# EasyEDA schematic SCH_night-light_2024-06-19.json
TITLE: Sheet_1; REV: 1.0; Date: 2024-06-19; Sheet: 1/1; Drawn By: ercrice; Company: Your Company
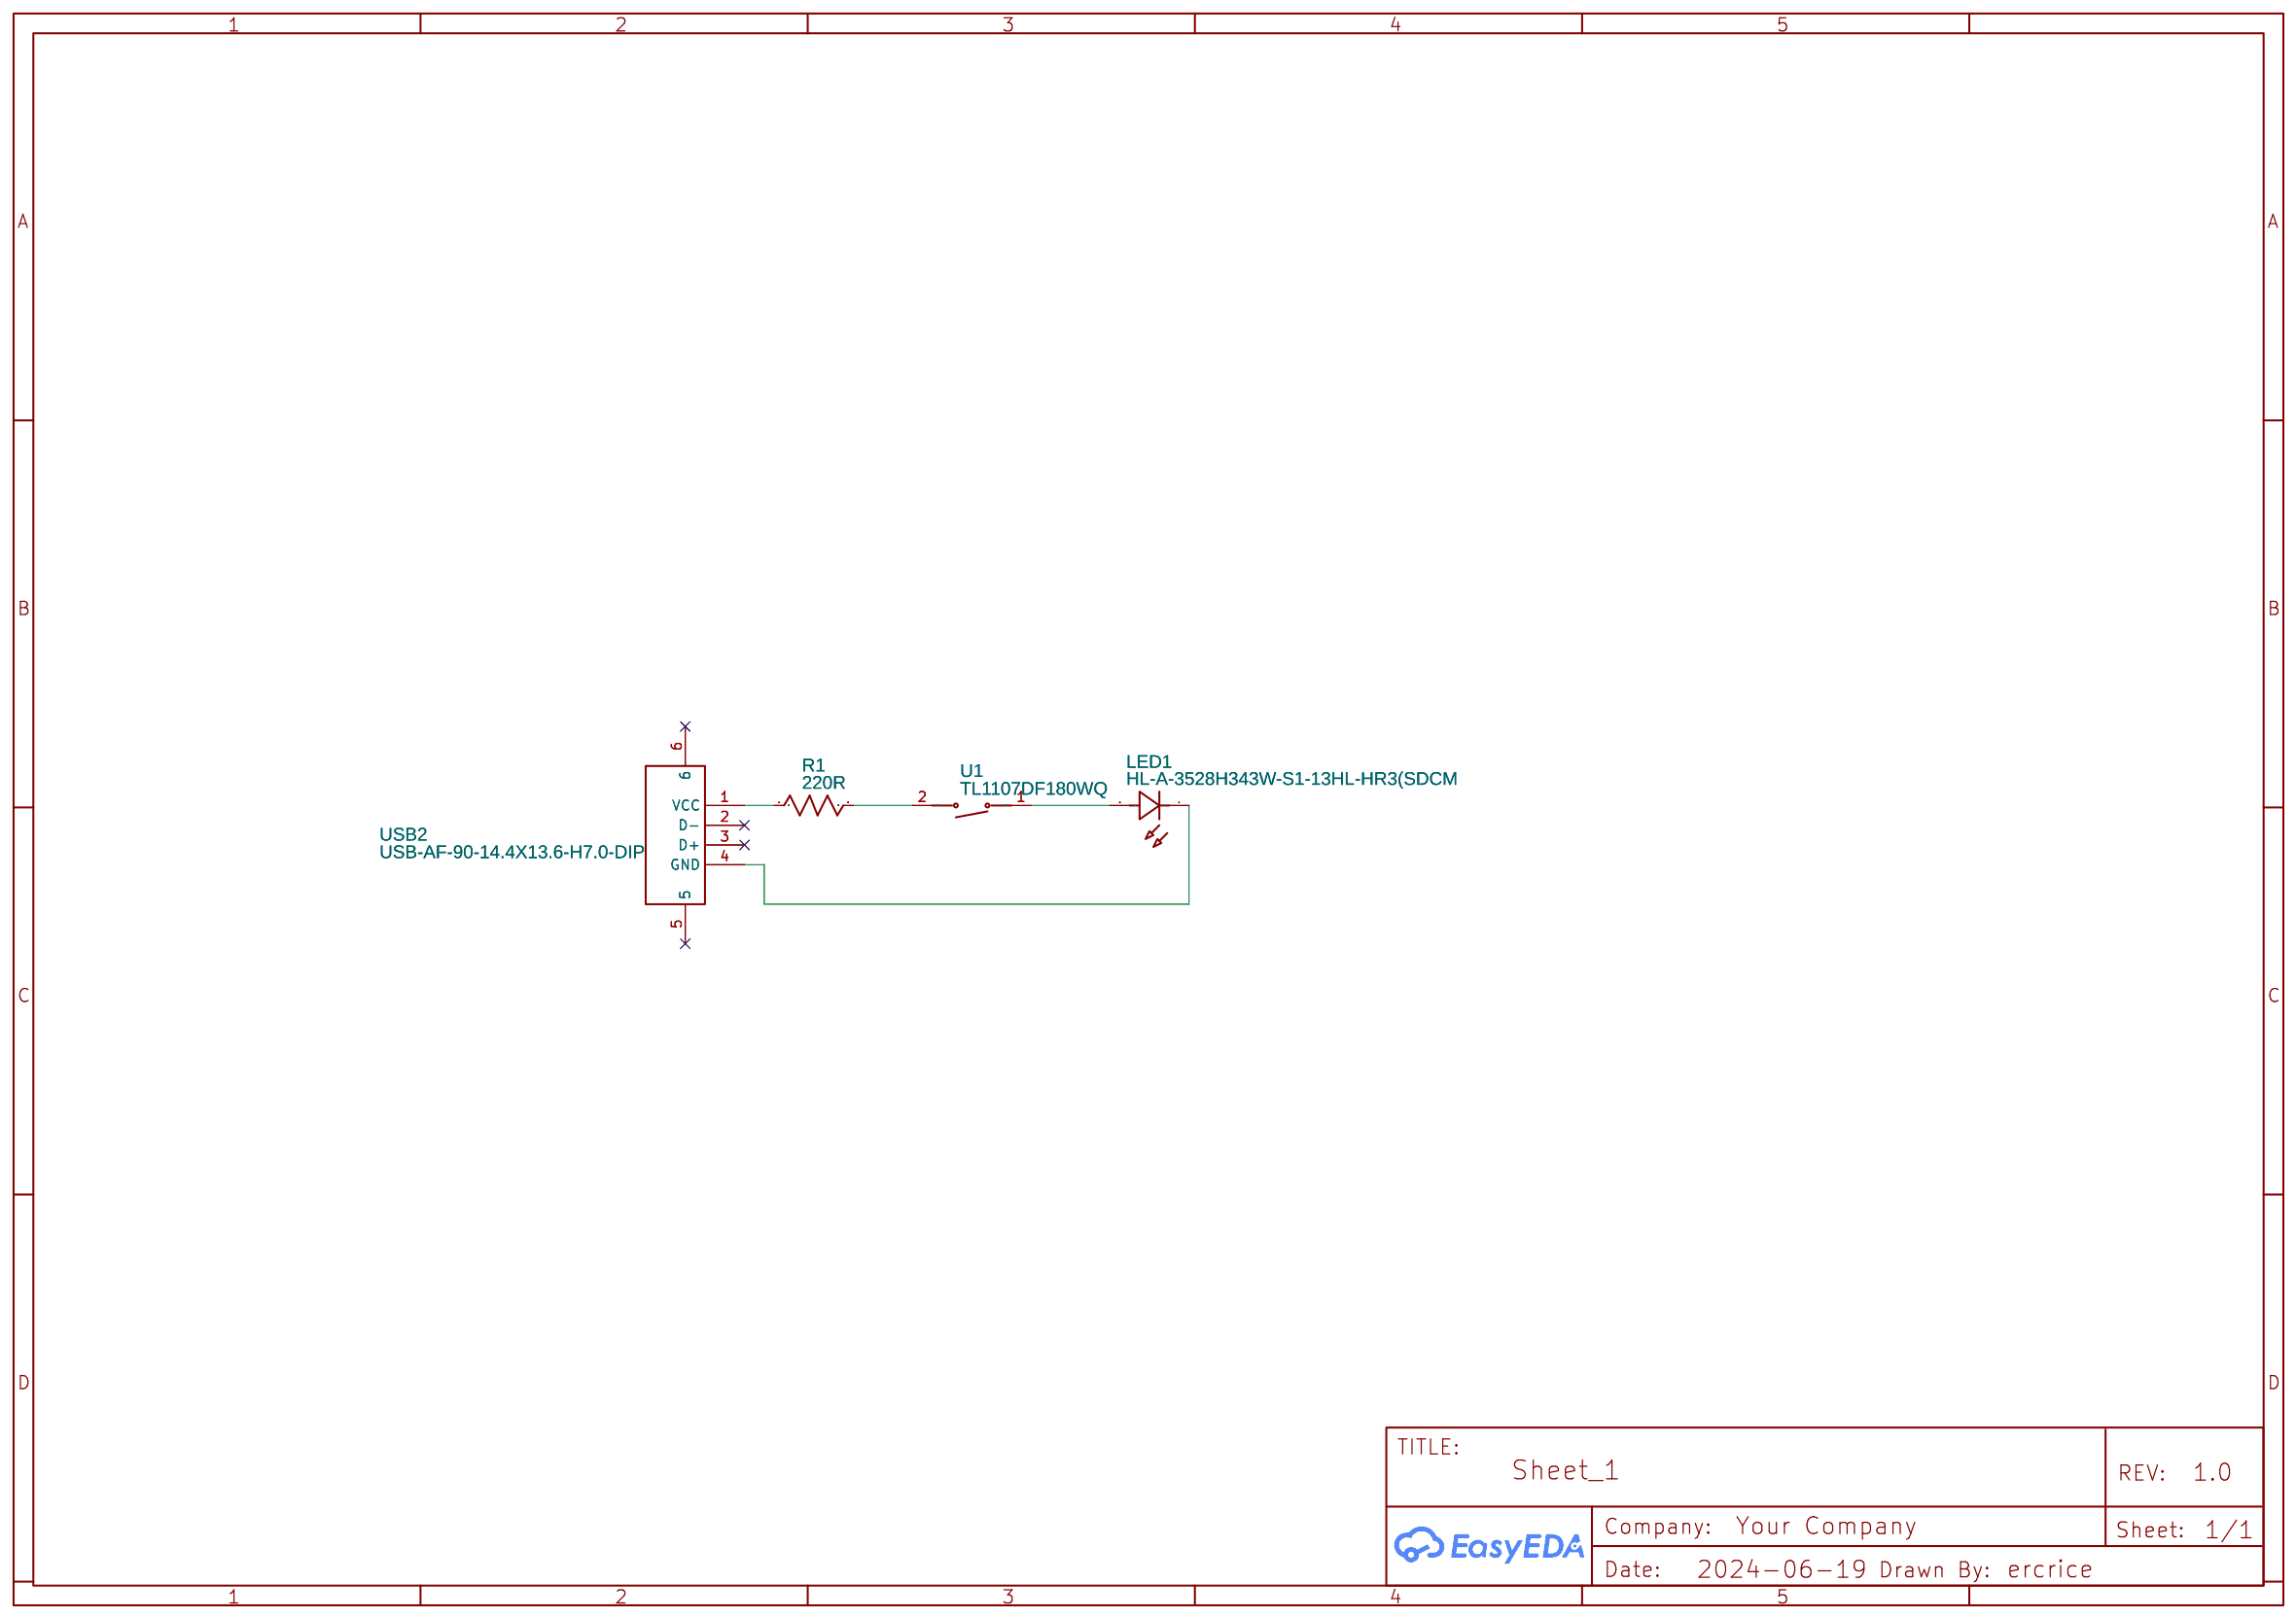
[diagram p0: schematic sheet]

## Parts
LED1  HL-A-3528H343W-S1-13HL-HR3(SDCM  [LED-SMD_L3.2-W2.8-LS3.5-RD_WHITE]
R1  220R  [R0603]
U1  TL1107DF180WQ  [SW-TH_L6.0-W3.5-P6.50]
USB2  USB-AF-90-14.4X13.6-H7.0-DIP  [USB-A-TH_C46407]

## Library data of the parts
LED1 = HL-A-3528H343W-S1-13HL-HR3(SDCM: Contributor: LCSC; Supplier: LCSC; Supplier Part: C516297; Manufacturer: HONGLITRONIC(鸿利光电); Manufacturer Part: HL-A-3528H343W-S1-13HL-HR3(SDCM<6)(4750K-5300K); JLCPCB Part Class: Extended Part
R1 = R_0603_US: Contributor: LCEDA_Lib
U1 = TL1107DF180WQ: Contributor: lcsc; Supplier: LCSC; Supplier Part: C4365097; Manufacturer: E-Switch
USB2 = USB-AF-90-14.4X13.6-H7.0-DIP: Contributor: LCSC; Supplier: LCSC; Supplier Part: C46407; Manufacturer: 精拓金; Manufacturer Part: 903-131A1011D10100; JLCPCB Part Class: Extended Part

## Nets
Net-(LED1-1): LED1.1(K) USB2.4(GND)
Net-(LED1-2): LED1.2(A) U1.1
Net-(R1-1): R1.1 USB2.1(VCC)
Net-(R1-2): R1.2 U1.2

Not connected (* = marked no-connect by the designer): USB2 2(D-)* 3(D+)* 5* 6*
